# EasyEDA schematic Schematic.json
TITLE: 7D_PCB; REV: 1.0; Date: 2022-05-18; Sheet: 1/1; Drawn By: khoolash; Company: Hoolash_Karanveer
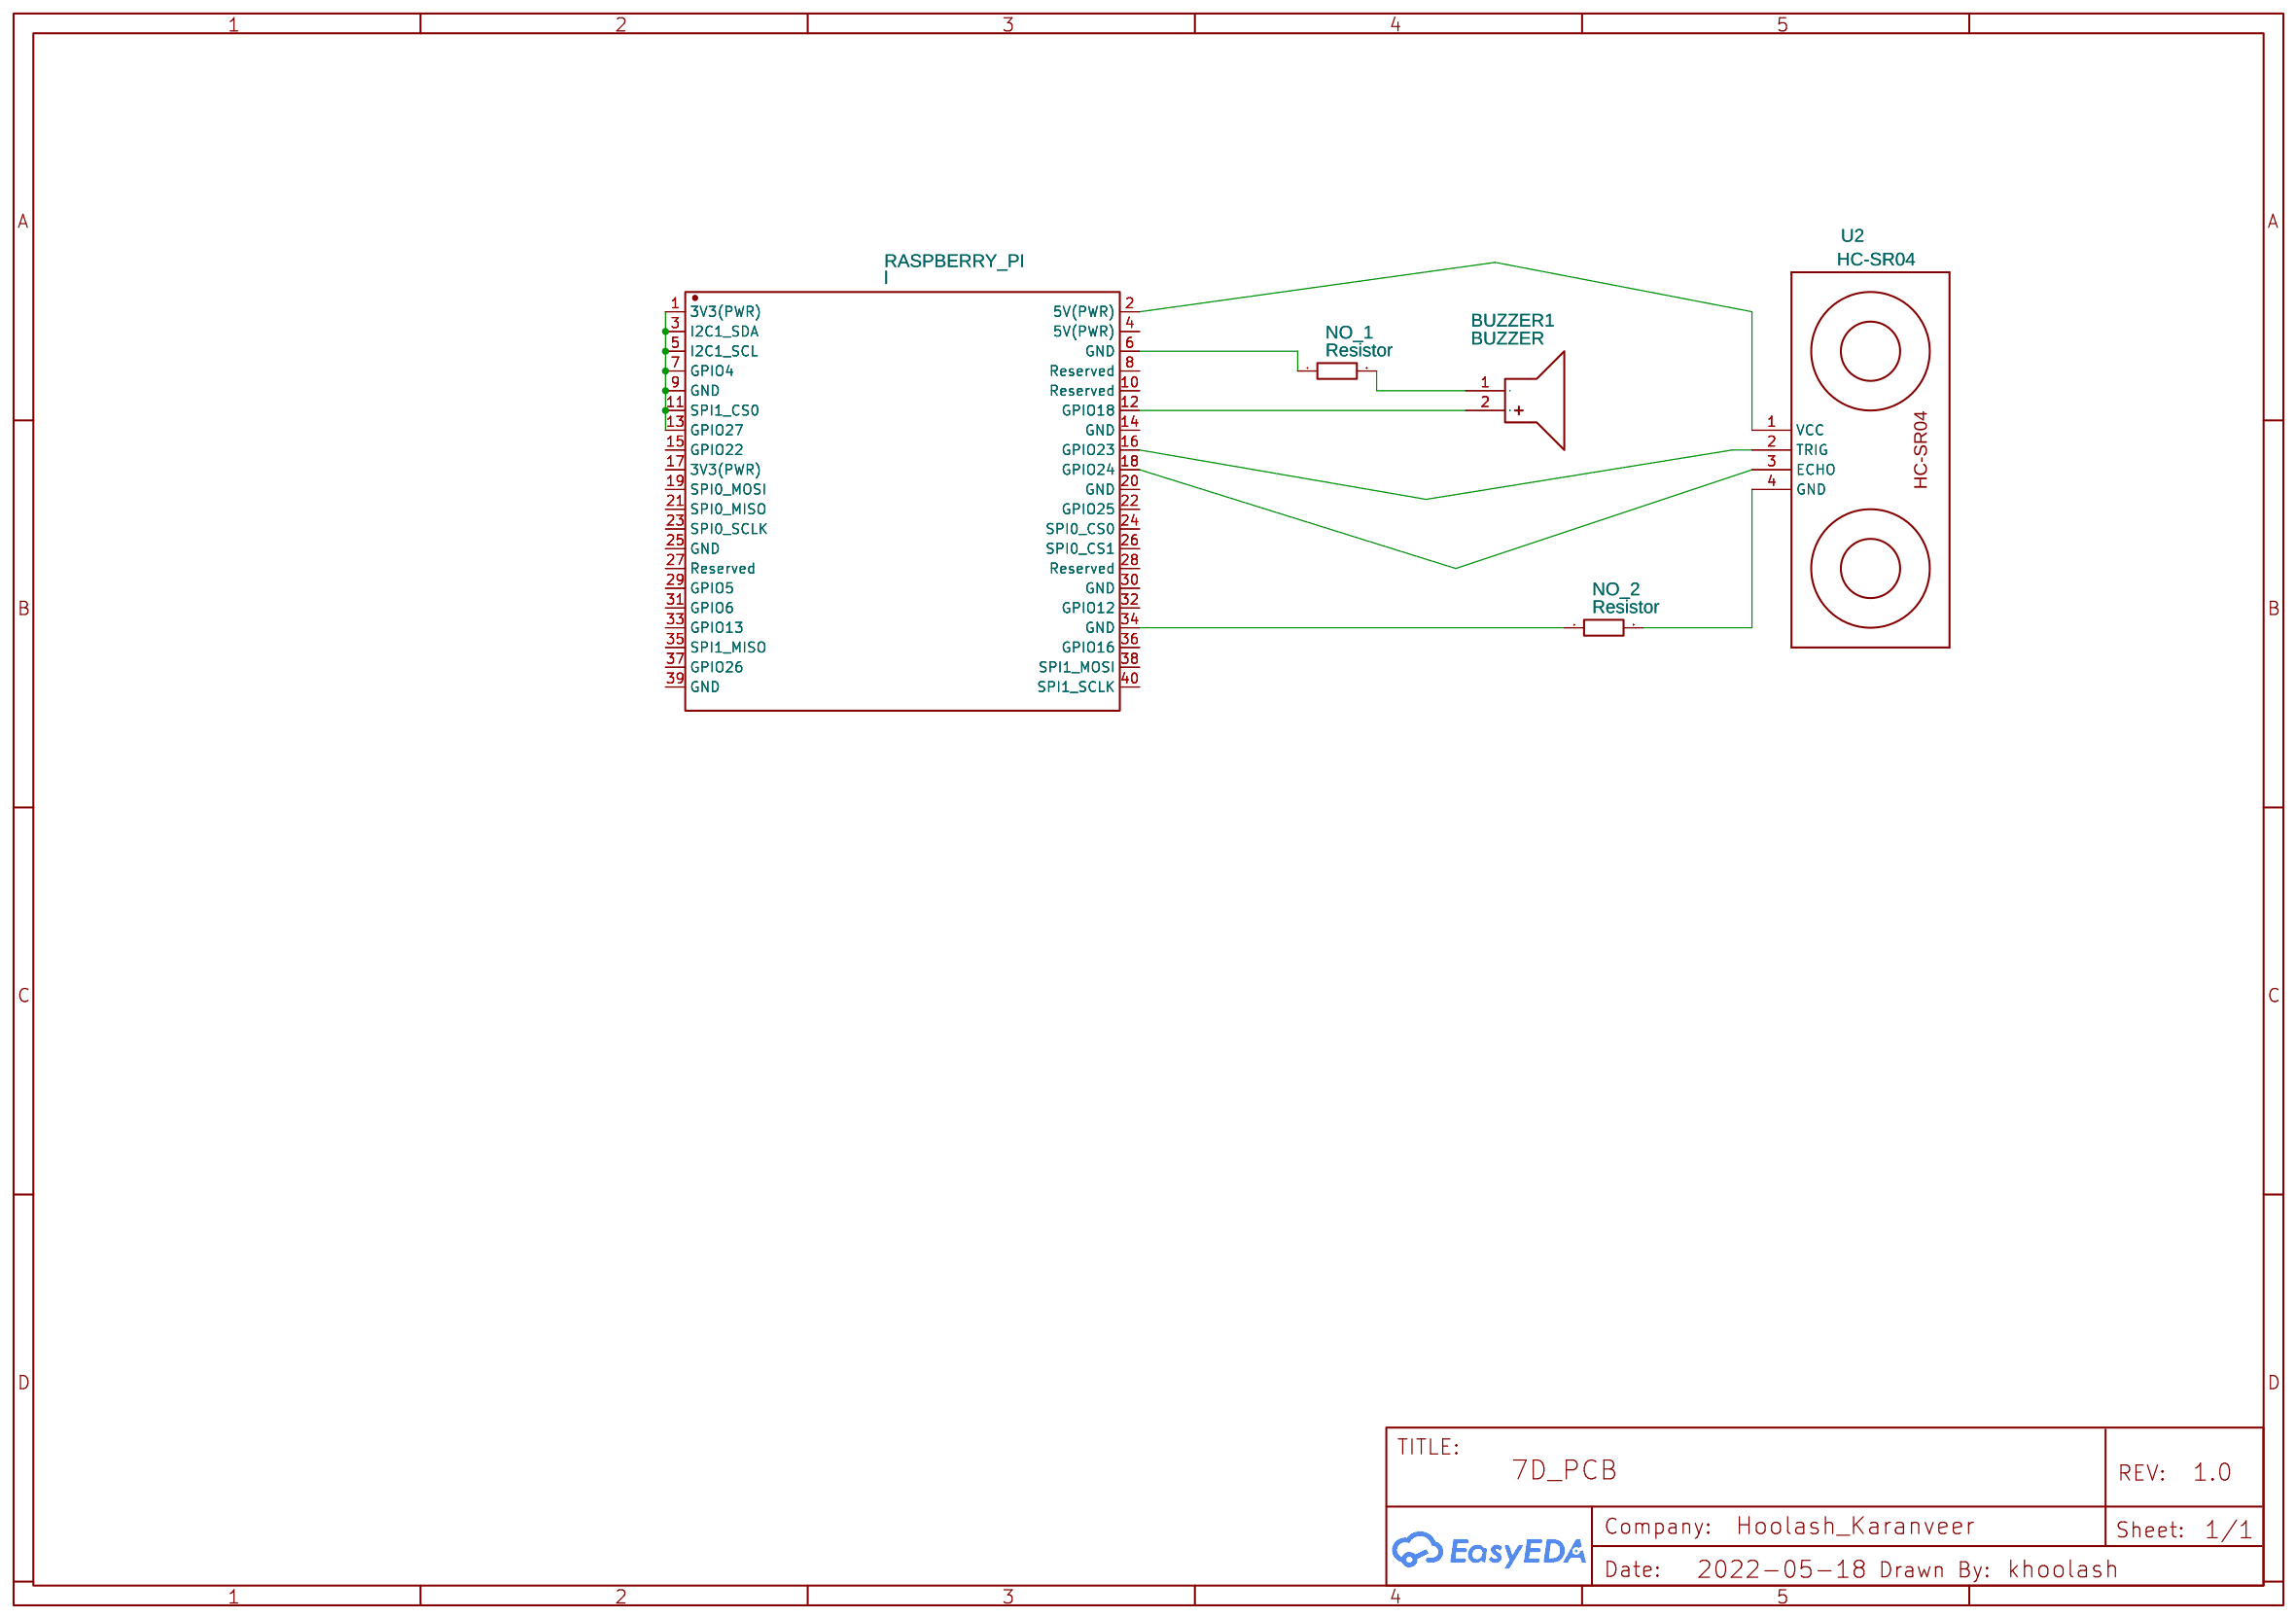
[diagram p0: schematic sheet]

## Parts
BUZZER1  BUZZER  [BUZ-TH_BD12.0-P6.00-D0.9-RD]
NO_1  Resistor  [RESISTOR 1/4 WATT 330 OHM]
NO_2  Resistor  [RESISTOR 1/4 WATT 330 OHM]
RASPBERRY_PI  l  [HDR2X20-REVERSED]
U2  HC-SR04  [HC-SR04]

## Library data of the parts
BUZZER1 = BUZZER: Supplier: LCSC; Supplier Part: C9900014030; Manufacturer: null; Manufacturer Part: buzzer; JLCPCB Part Class: Extended Part; Contributor: lcsc
NO_1 NO_2 = 330: Contributor: Hendriyana
RASPBERRY_PI = Raspberry Pi 2: Contributor: Jason+Pierce; sourceId: gQK2WevN5
U2 = HC-SR04: Manufacturer Part: ServoMotor; Contributor: srimbey

## Nets
Net-(BUZZER1-1): BUZZER1.1(-) NO_1.2
Net-(BUZZER1-2): BUZZER1.2(+) RASPBERRY_PI.12(GPIO18)
Net-(NO_1-1): NO_1.1 RASPBERRY_PI.6(GND)
Net-(NO_2-1): NO_2.1 RASPBERRY_PI.34(GND)
Net-(NO_2-2): NO_2.2 U2.4(GND)
Net-(RASPBERRY_PI-1): RASPBERRY_PI.1(3V3(PWR)) RASPBERRY_PI.3(I2C1 SDA) RASPBERRY_PI.5(I2C1 SCL) RASPBERRY_PI.7(GPIO4) RASPBERRY_PI.9(GND) RASPBERRY_PI.11(SPI1 CS0) RASPBERRY_PI.13(GPIO27)
Net-(RASPBERRY_PI-2): RASPBERRY_PI.2(5V(PWR)) U2.1(VCC)
Net-(RASPBERRY_PI-16): RASPBERRY_PI.16(GPIO23) U2.2(TRIG)
Net-(RASPBERRY_PI-18): RASPBERRY_PI.18(GPIO24) U2.3(ECHO)

Not connected (* = marked no-connect by the designer): RASPBERRY_PI 4(5V(PWR)) 8(Reserved) 10(Reserved) 14(GND) 15(GPIO22) 17(3V3(PWR)) 19(SPI0 MOSI) 20(GND) 21(SPI0 MISO) 22(GPIO25) 23(SPI0 SCLK) 24(SPI0 CS0) 25(GND) 26(SPI0 CS1) 27(Reserved) 28(Reserved) 29(GPIO5) 30(GND) 31(GPIO6) 32(GPIO12) 33(GPIO13) 35(SPI1 MISO) 36(GPIO16) 37(GPIO26) 38(SPI1 MOSI) 39(GND) 40(SPI1 SCLK)
